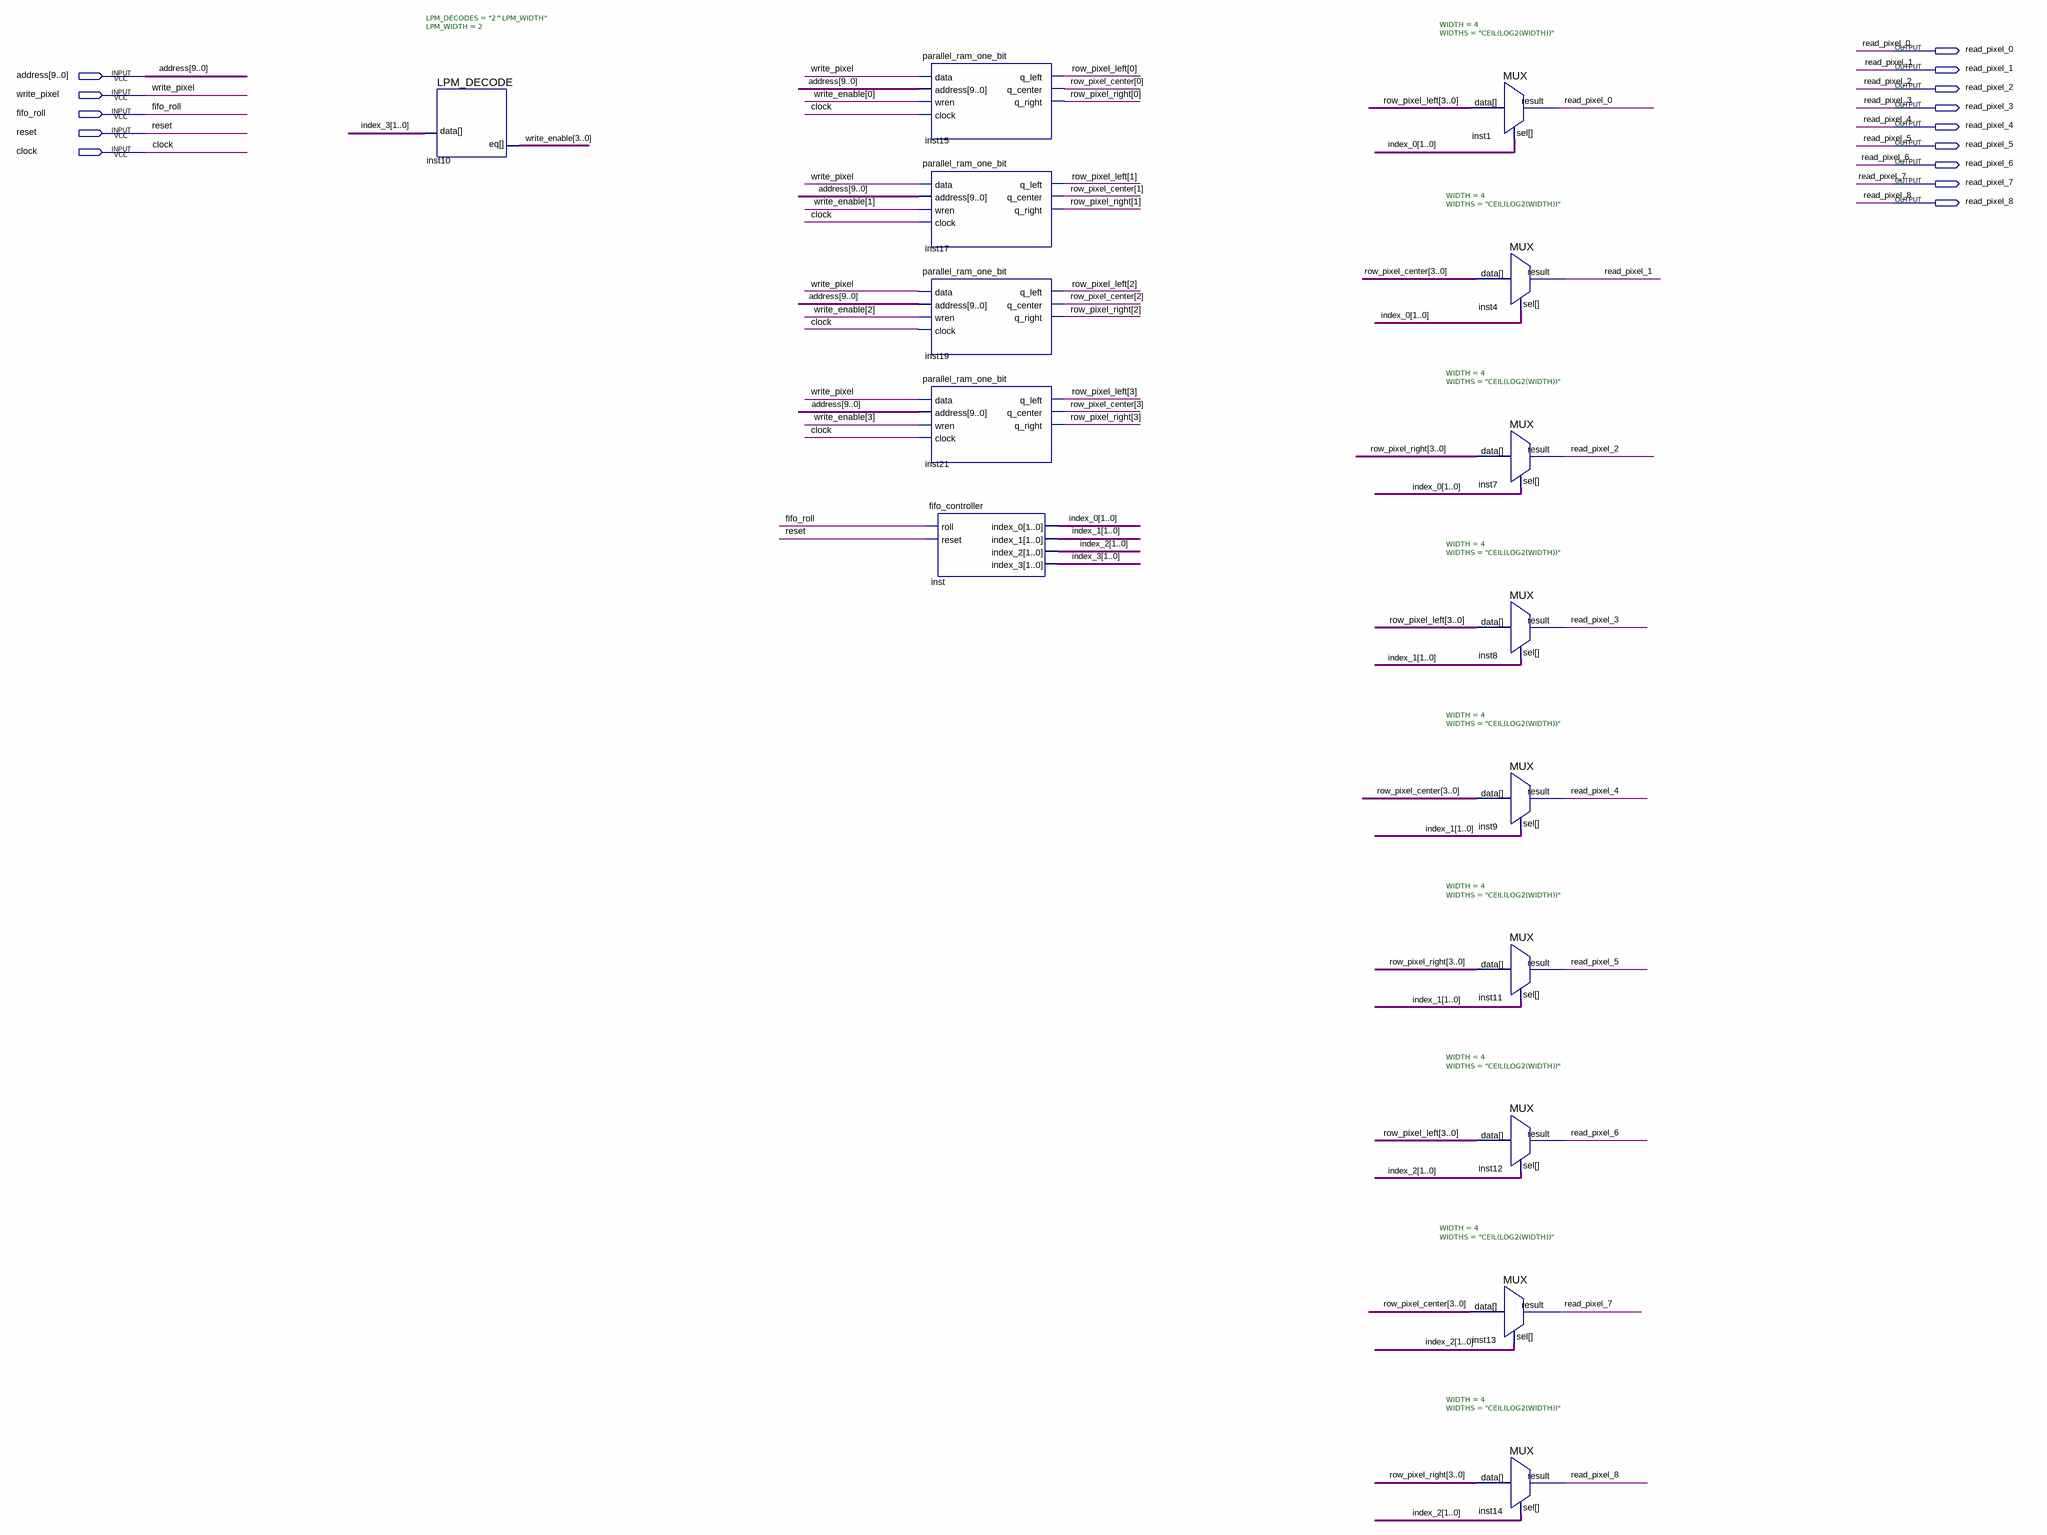
[diagram p0: schematic sheet]
// Quartus schematic row_fifo_one_bit.bdf as structural Verilog: 15 symbols, 14 pins
module row_fifo_one_bit (
  input  [9:0] address,
  input  write_pixel,
  input  fifo_roll,
  input  reset,
  input  clock,
  output read_pixel_0,
  output read_pixel_1,
  output read_pixel_2,
  output read_pixel_3,
  output read_pixel_4,
  output read_pixel_5,
  output read_pixel_6,
  output read_pixel_7,
  output read_pixel_8
);

  wire [1:0] index_0, index_1, index_2, index_3;
  wire [3:0] row_pixel_center, row_pixel_left, row_pixel_right, write_enable;

  LPM_DECODE #(.LPM_DECODES("2^LPM_WIDTH"), .LPM_WIDTH(2)) inst10 (.data(index_3), .eq(write_enable));
  parallel_ram_one_bit inst15 (
    .data(write_pixel), .address(address), .wren(write_enable[0]), .clock(clock), .q_left(row_pixel_left[0]),
    .q_center(row_pixel_center[0]), .q_right(row_pixel_right[0]));
  parallel_ram_one_bit inst17 (
    .data(write_pixel), .address(address), .wren(write_enable[1]), .clock(clock), .q_left(row_pixel_left[1]),
    .q_center(row_pixel_center[1]), .q_right(row_pixel_right[1]));
  parallel_ram_one_bit inst19 (
    .data(write_pixel), .address(address), .wren(write_enable[2]), .clock(clock), .q_left(row_pixel_left[2]),
    .q_center(row_pixel_center[2]), .q_right(row_pixel_right[2]));
  parallel_ram_one_bit inst21 (
    .data(write_pixel), .address(address), .wren(write_enable[3]), .clock(clock), .q_left(row_pixel_left[3]),
    .q_center(row_pixel_center[3]), .q_right(row_pixel_right[3]));
  fifo_controller inst (
    .roll(fifo_roll), .reset(reset), .index_0(index_0), .index_1(index_1), .index_2(index_2),
    .index_3(index_3));
  MUX #(.WIDTH(4), .WIDTHS("CEIL(LOG2(WIDTH))")) inst1 (.data(row_pixel_left), .sel(index_0), .result(read_pixel_0));
  MUX #(.WIDTH(4), .WIDTHS("CEIL(LOG2(WIDTH))")) inst4 (.data(row_pixel_center), .sel(index_0), .result(read_pixel_1));
  MUX #(.WIDTH(4), .WIDTHS("CEIL(LOG2(WIDTH))")) inst7 (.data(row_pixel_right), .sel(index_0), .result(read_pixel_2));
  MUX #(.WIDTH(4), .WIDTHS("CEIL(LOG2(WIDTH))")) inst8 (.data(row_pixel_left), .sel(index_1), .result(read_pixel_3));
  MUX #(.WIDTH(4), .WIDTHS("CEIL(LOG2(WIDTH))")) inst9 (.data(row_pixel_center), .sel(index_1), .result(read_pixel_4));
  MUX #(.WIDTH(4), .WIDTHS("CEIL(LOG2(WIDTH))")) inst11 (.data(row_pixel_right), .sel(index_1), .result(read_pixel_5));
  MUX #(.WIDTH(4), .WIDTHS("CEIL(LOG2(WIDTH))")) inst12 (.data(row_pixel_left), .sel(index_2), .result(read_pixel_6));
  MUX #(.WIDTH(4), .WIDTHS("CEIL(LOG2(WIDTH))")) inst13 (.data(row_pixel_center), .sel(index_2), .result(read_pixel_7));
  MUX #(.WIDTH(4), .WIDTHS("CEIL(LOG2(WIDTH))")) inst14 (.data(row_pixel_right), .sel(index_2), .result(read_pixel_8));
endmodule
